# Altium schematic sheet [07] - OTHER.SchDoc
size A3; DocumentNumber: 8; SheetNumber: 7; SheetTotal: 10
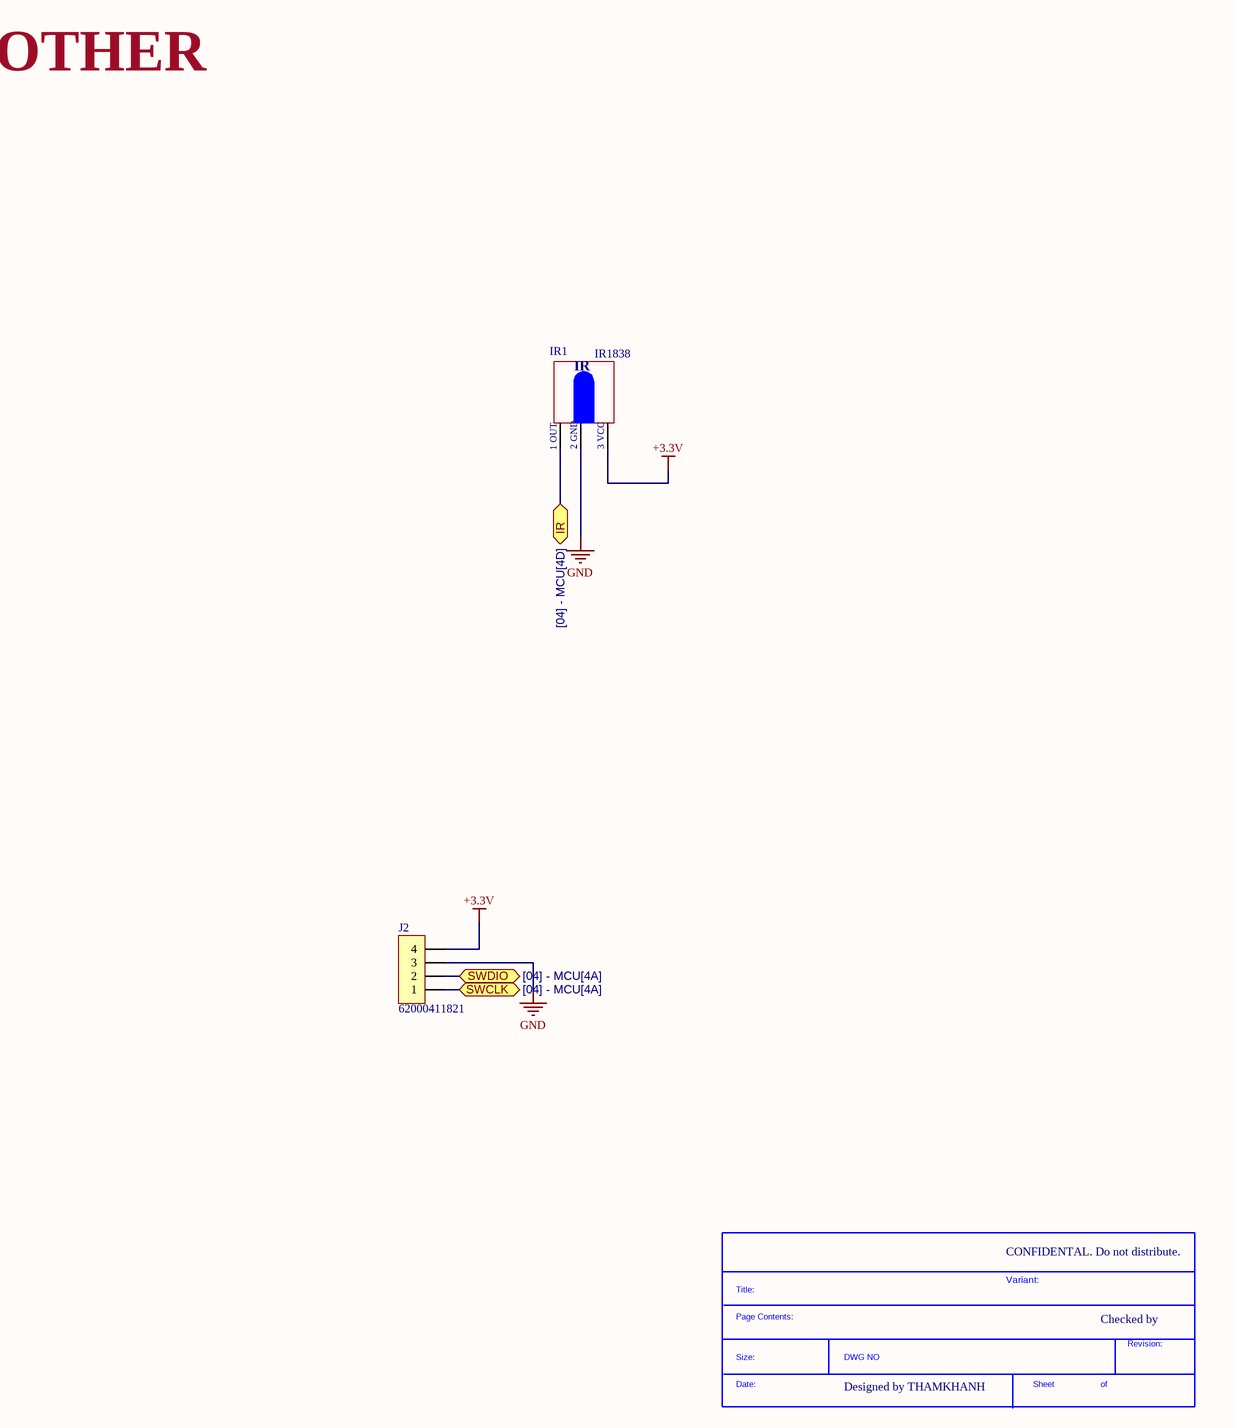
[diagram p0: [07] - OTHER.SchDoc]

## Parts
*?  SDTitleBlock  (value not drawn)  (graphical)
IR1  IR1838  [IR RECEIVE V1]
J2  62000411821  [62000411121]

## Ports
IR (bidir, see [04] - MCU[4D]), SWCLK (bidir, see [04] - MCU[4A]), SWDIO (bidir, see [04] - MCU[4A])

## Nets
+3.3V: IR1.3(VCC) J2.4
GND: IR1.2(GND) J2.3
IR: IR1.1(Out) ; port IR
SWCLK: J2.1 ; port SWCLK
SWDIO: J2.2 ; port SWDIO

## Notes on the sheet
- OTHER
- CONFIDENTAL. Do not distribute.
- Variant:
- Checked by
- Designed by THAMKHANH
- (in symbol IR1838) IR; 1 OUT; 2 GND; 3 VCC
- (in symbol SDTitleBlock) Title:; Page Contents:; Revision:; Size:; DWG NO; Date:; Sheet; of

## Library data of the parts
IR1 = IR1838: VISHAY SEMICONDUCTOR   TSOP31238   IR RECEIVER, 40M, 38KHZ, SIP
J2 = JP4 2.00MM Single Socket: WR-PHD 2.00 mm Socket Header; Manufacturer: W¨¹rth Elektronik eiSos GmbH; ComponentLink1 Description: Manufacturer; ComponentLink2 Description: Datasheet; NoPins: 04; Created Date: 2 April 2013; partNo: 62000411821; ComponentLink1URL: http://www.we-online.com; ComponentLink2URL: http://katalog.we-online.de/em/datasheet/6200xx11821.pdf; Created by: Karrer Zheng